# Altium schematic sheet 12vto15v mosfet control.SchDoc
size A; SheetNumber: 2; SheetTotal: 4
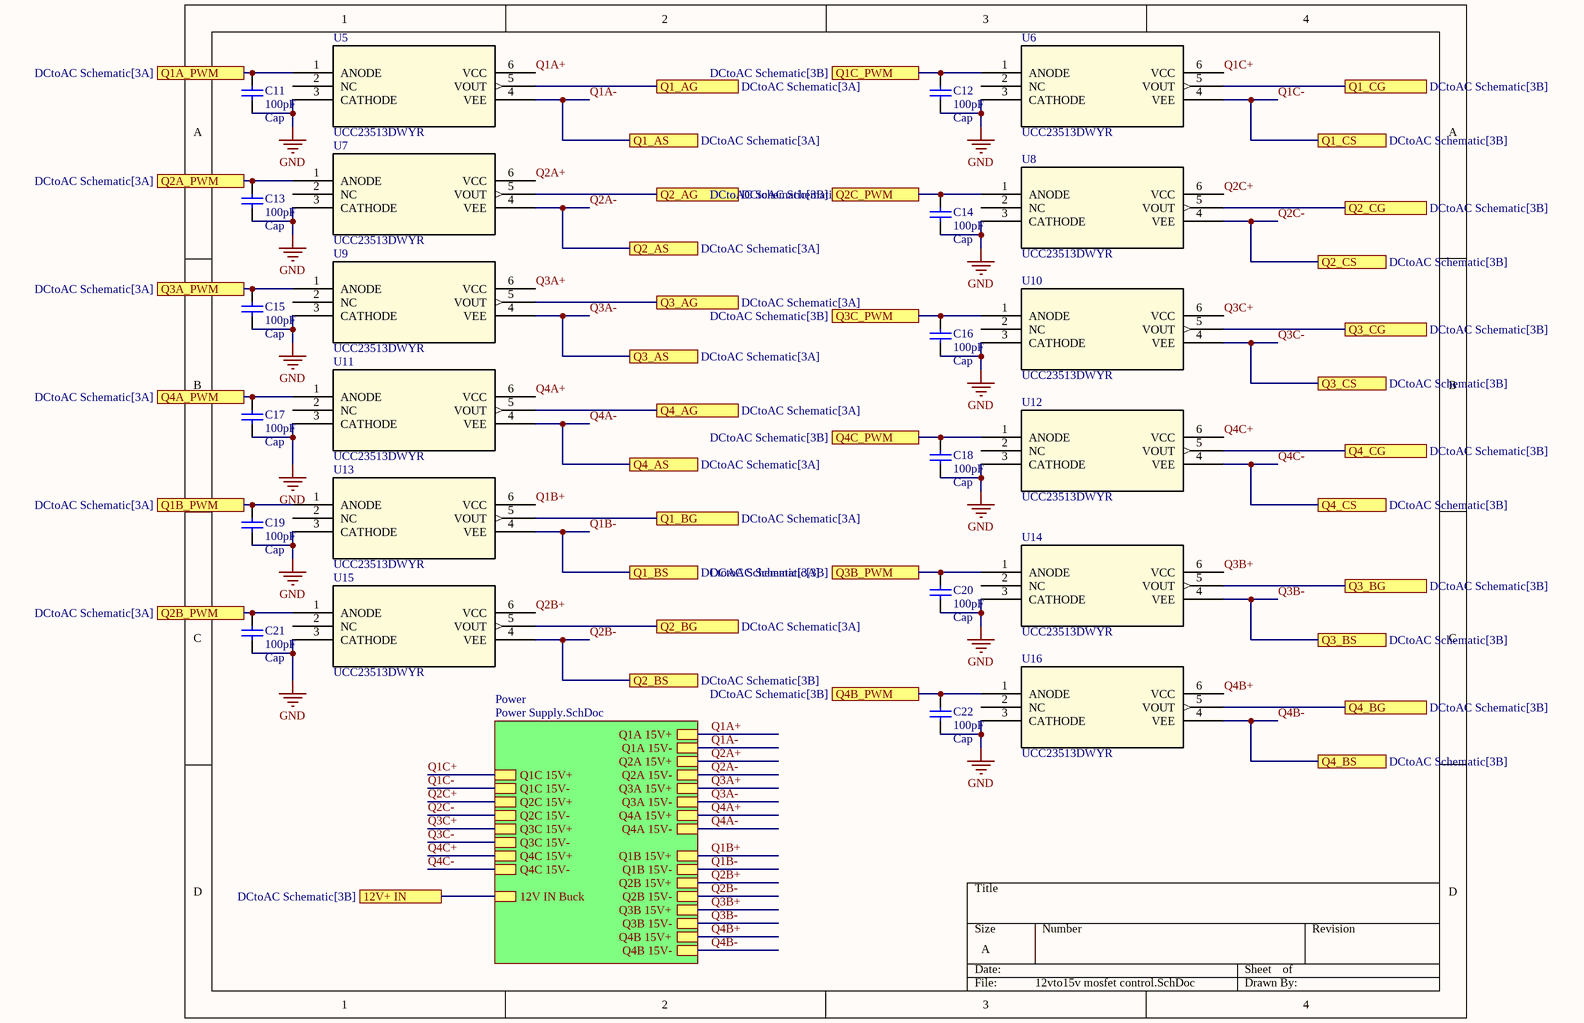
[diagram p0: 12vto15v mosfet control.SchDoc]

## Parts
C11  Cap  value 100pF  [RAD-0.3]
C12  Cap  value 100pF  [RAD-0.3]
C13  Cap  value 100pF  [RAD-0.3]
C14  Cap  value 100pF  [RAD-0.3]
C15  Cap  value 100pF  [RAD-0.3]
C16  Cap  value 100pF  [RAD-0.3]
C17  Cap  value 100pF  [RAD-0.3]
C18  Cap  value 100pF  [RAD-0.3]
C19  Cap  value 100pF  [RAD-0.3]
C20  Cap  value 100pF  [RAD-0.3]
C21  Cap  value 100pF  [RAD-0.3]
C22  Cap  value 100pF  [RAD-0.3]
U5  UCC23513DWYR  [DWY6_TEX]
U6  UCC23513DWYR  [DWY6_TEX]
U7  UCC23513DWYR  [DWY6_TEX]
U8  UCC23513DWYR  [DWY6_TEX]
U9  UCC23513DWYR  [DWY6_TEX]
U10  UCC23513DWYR  [DWY6_TEX]
U11  UCC23513DWYR  [DWY6_TEX]
U12  UCC23513DWYR  [DWY6_TEX]
U13  UCC23513DWYR  [DWY6_TEX]
U14  UCC23513DWYR  [DWY6_TEX]
U15  UCC23513DWYR  [DWY6_TEX]
U16  UCC23513DWYR  [DWY6_TEX]

## Sub-sheets
Power = Power Supply.SchDoc: Q1A 15V+, Q1A 15V-, Q2A 15V+, Q2A 15V-, Q3A 15V+, Q3A 15V-, Q4A 15V+, Q4A 15V-, Q1B 15V+, Q1B 15V-, Q2B 15V+, Q2B 15V-, Q3B 15V+, Q3B 15V-, Q4B 15V+, Q4B 15V-, Q1C 15V+, Q1C 15V-, Q2C 15V+, Q2C 15V-, Q3C 15V+, Q3C 15V-, Q4C 15V+, Q4C 15V-, 12V IN Buck

## Ports
12V+ IN (see DCtoAC Schematic[3B]), Q1_AG (see DCtoAC Schematic[3A]), Q1_AS (see DCtoAC Schematic[3A]), Q1_BG (see DCtoAC Schematic[3A]), Q1_BS (see DCtoAC Schematic[3A]), Q1_CG (see DCtoAC Schematic[3B]), Q1_CS (see DCtoAC Schematic[3B]), Q1A_PWM (see DCtoAC Schematic[3A]), Q1B_PWM (see DCtoAC Schematic[3A]), Q1C_PWM (see DCtoAC Schematic[3B]), Q2_AG (see DCtoAC Schematic[3A]), Q2_AS (see DCtoAC Schematic[3A]), Q2_BG (see DCtoAC Schematic[3A]), Q2_BS (see DCtoAC Schematic[3B]), Q2_CG (see DCtoAC Schematic[3B]), Q2_CS (see DCtoAC Schematic[3B]), Q2A_PWM (see DCtoAC Schematic[3A]), Q2B_PWM (see DCtoAC Schematic[3A]), Q2C_PWM (see DCtoAC Schematic[3B]), Q3_AG (see DCtoAC Schematic[3A]), Q3_AS (see DCtoAC Schematic[3A]), Q3_BG (see DCtoAC Schematic[3B]), Q3_BS (see DCtoAC Schematic[3B]), Q3_CG (see DCtoAC Schematic[3B]), Q3_CS (see DCtoAC Schematic[3B]), Q3A_PWM (see DCtoAC Schematic[3A]), Q3B_PWM (see DCtoAC Schematic[3B]), Q3C_PWM (see DCtoAC Schematic[3B]), Q4_AG (see DCtoAC Schematic[3A]), Q4_AS (see DCtoAC Schematic[3A]), Q4_BG (see DCtoAC Schematic[3B]), Q4_BS (see DCtoAC Schematic[3B]), Q4_CG (see DCtoAC Schematic[3B]), Q4_CS (see DCtoAC Schematic[3B]), Q4A_PWM (see DCtoAC Schematic[3A]), Q4B_PWM (see DCtoAC Schematic[3B]), Q4C_PWM (see DCtoAC Schematic[3B])

## Nets
GND: C11.1 C12.1 C13.1 C14.1 C15.1 C16.1 C17.1 C18.1 C19.1 C20.1 C21.1 C22.1 U5.3(CATHODE) U6.3(CATHODE) U7.3(CATHODE) U8.3(CATHODE) U9.3(CATHODE) U10.3(CATHODE) U11.3(CATHODE) U12.3(CATHODE) U13.3(CATHODE) U14.3(CATHODE) U15.3(CATHODE) U16.3(CATHODE)
12V+ IN: port 12V+ IN, sheet Power/12V IN Buck
Q1_AG: U5.5(VOUT) ; port Q1_AG
Q1_BG: U13.5(VOUT) ; port Q1_BG
Q1_CG: U6.5(VOUT) ; port Q1_CG
Q1A+: U5.6(VCC) ; sheet Power/Q1A 15V+
Q1A-: U5.4(VEE) ; port Q1_AS, sheet Power/Q1A 15V-
Q1A_PWM: C11.2 U5.1(ANODE) ; port Q1A_PWM
Q1B+: U13.6(VCC) ; sheet Power/Q1B 15V+
Q1B-: U13.4(VEE) ; port Q1_BS, sheet Power/Q1B 15V-
Q1B_PWM: C19.2 U13.1(ANODE) ; port Q1B_PWM
Q1C+: U6.6(VCC) ; sheet Power/Q1C 15V+
Q1C-: U6.4(VEE) ; port Q1_CS, sheet Power/Q1C 15V-
Q1C_PWM: C12.2 U6.1(ANODE) ; port Q1C_PWM
Q2_AG: U7.5(VOUT) ; port Q2_AG
Q2_BG: U15.5(VOUT) ; port Q2_BG
Q2_CG: U8.5(VOUT) ; port Q2_CG
Q2A+: U7.6(VCC) ; sheet Power/Q2A 15V+
Q2A-: U7.4(VEE) ; port Q2_AS, sheet Power/Q2A 15V-
Q2A_PWM: C13.2 U7.1(ANODE) ; port Q2A_PWM
Q2B+: U15.6(VCC) ; sheet Power/Q2B 15V+
Q2B-: U15.4(VEE) ; port Q2_BS, sheet Power/Q2B 15V-
Q2B_PWM: C21.2 U15.1(ANODE) ; port Q2B_PWM
Q2C+: U8.6(VCC) ; sheet Power/Q2C 15V+
Q2C-: U8.4(VEE) ; port Q2_CS, sheet Power/Q2C 15V-
Q2C_PWM: C14.2 U8.1(ANODE) ; port Q2C_PWM
Q3_AG: U9.5(VOUT) ; port Q3_AG
Q3_BG: U14.5(VOUT) ; port Q3_BG
Q3_CG: U10.5(VOUT) ; port Q3_CG
Q3A+: U9.6(VCC) ; sheet Power/Q3A 15V+
Q3A-: U9.4(VEE) ; port Q3_AS, sheet Power/Q3A 15V-
Q3A_PWM: C15.2 U9.1(ANODE) ; port Q3A_PWM
Q3B+: U14.6(VCC) ; sheet Power/Q3B 15V+
Q3B-: U14.4(VEE) ; port Q3_BS, sheet Power/Q3B 15V-
Q3B_PWM: C20.2 U14.1(ANODE) ; port Q3B_PWM
Q3C+: U10.6(VCC) ; sheet Power/Q3C 15V+
Q3C-: U10.4(VEE) ; port Q3_CS, sheet Power/Q3C 15V-
Q3C_PWM: C16.2 U10.1(ANODE) ; port Q3C_PWM
Q4_AG: U11.5(VOUT) ; port Q4_AG
Q4_BG: U16.5(VOUT) ; port Q4_BG
Q4_CG: U12.5(VOUT) ; port Q4_CG
Q4A+: U11.6(VCC) ; sheet Power/Q4A 15V+
Q4A-: U11.4(VEE) ; port Q4_AS, sheet Power/Q4A 15V-
Q4A_PWM: C17.2 U11.1(ANODE) ; port Q4A_PWM
Q4B+: U16.6(VCC) ; sheet Power/Q4B 15V+
Q4B-: U16.4(VEE) ; port Q4_BS, sheet Power/Q4B 15V-
Q4B_PWM: C22.2 U16.1(ANODE) ; port Q4B_PWM
Q4C+: U12.6(VCC) ; sheet Power/Q4C 15V+
Q4C-: U12.4(VEE) ; port Q4_CS, sheet Power/Q4C 15V-
Q4C_PWM: C18.2 U12.1(ANODE) ; port Q4C_PWM

Not connected (* = marked no-connect by the designer): U5 2(NC); U6 2(NC); U7 2(NC); U8 2(NC); U9 2(NC); U10 2(NC); U11 2(NC); U12 2(NC); U13 2(NC); U14 2(NC); U15 2(NC); U16 2(NC)

## Library data of the parts
C11-C22 = Cap: Capacitor; Published: 8-Jun-2000; LatestRevisionDate: 17-Jul-2002; LatestRevisionNote: Re-released for DXP Platform.; PackageReference: RAD-0.3; Publisher: Altium Limited; PackageDescription: Radial Cap, Thru-Hole; 2 Leads; 0.3 in Pin Spacing
U5-U16 = UCC23513DWYR: No Description Available; Mfr_Name: Texas Instruments; RefDes: RefDes; Type: Type